# Altium schematic sheet USB2_Replication.SchDoc
size B; SheetNumber: 4; SheetTotal: 11
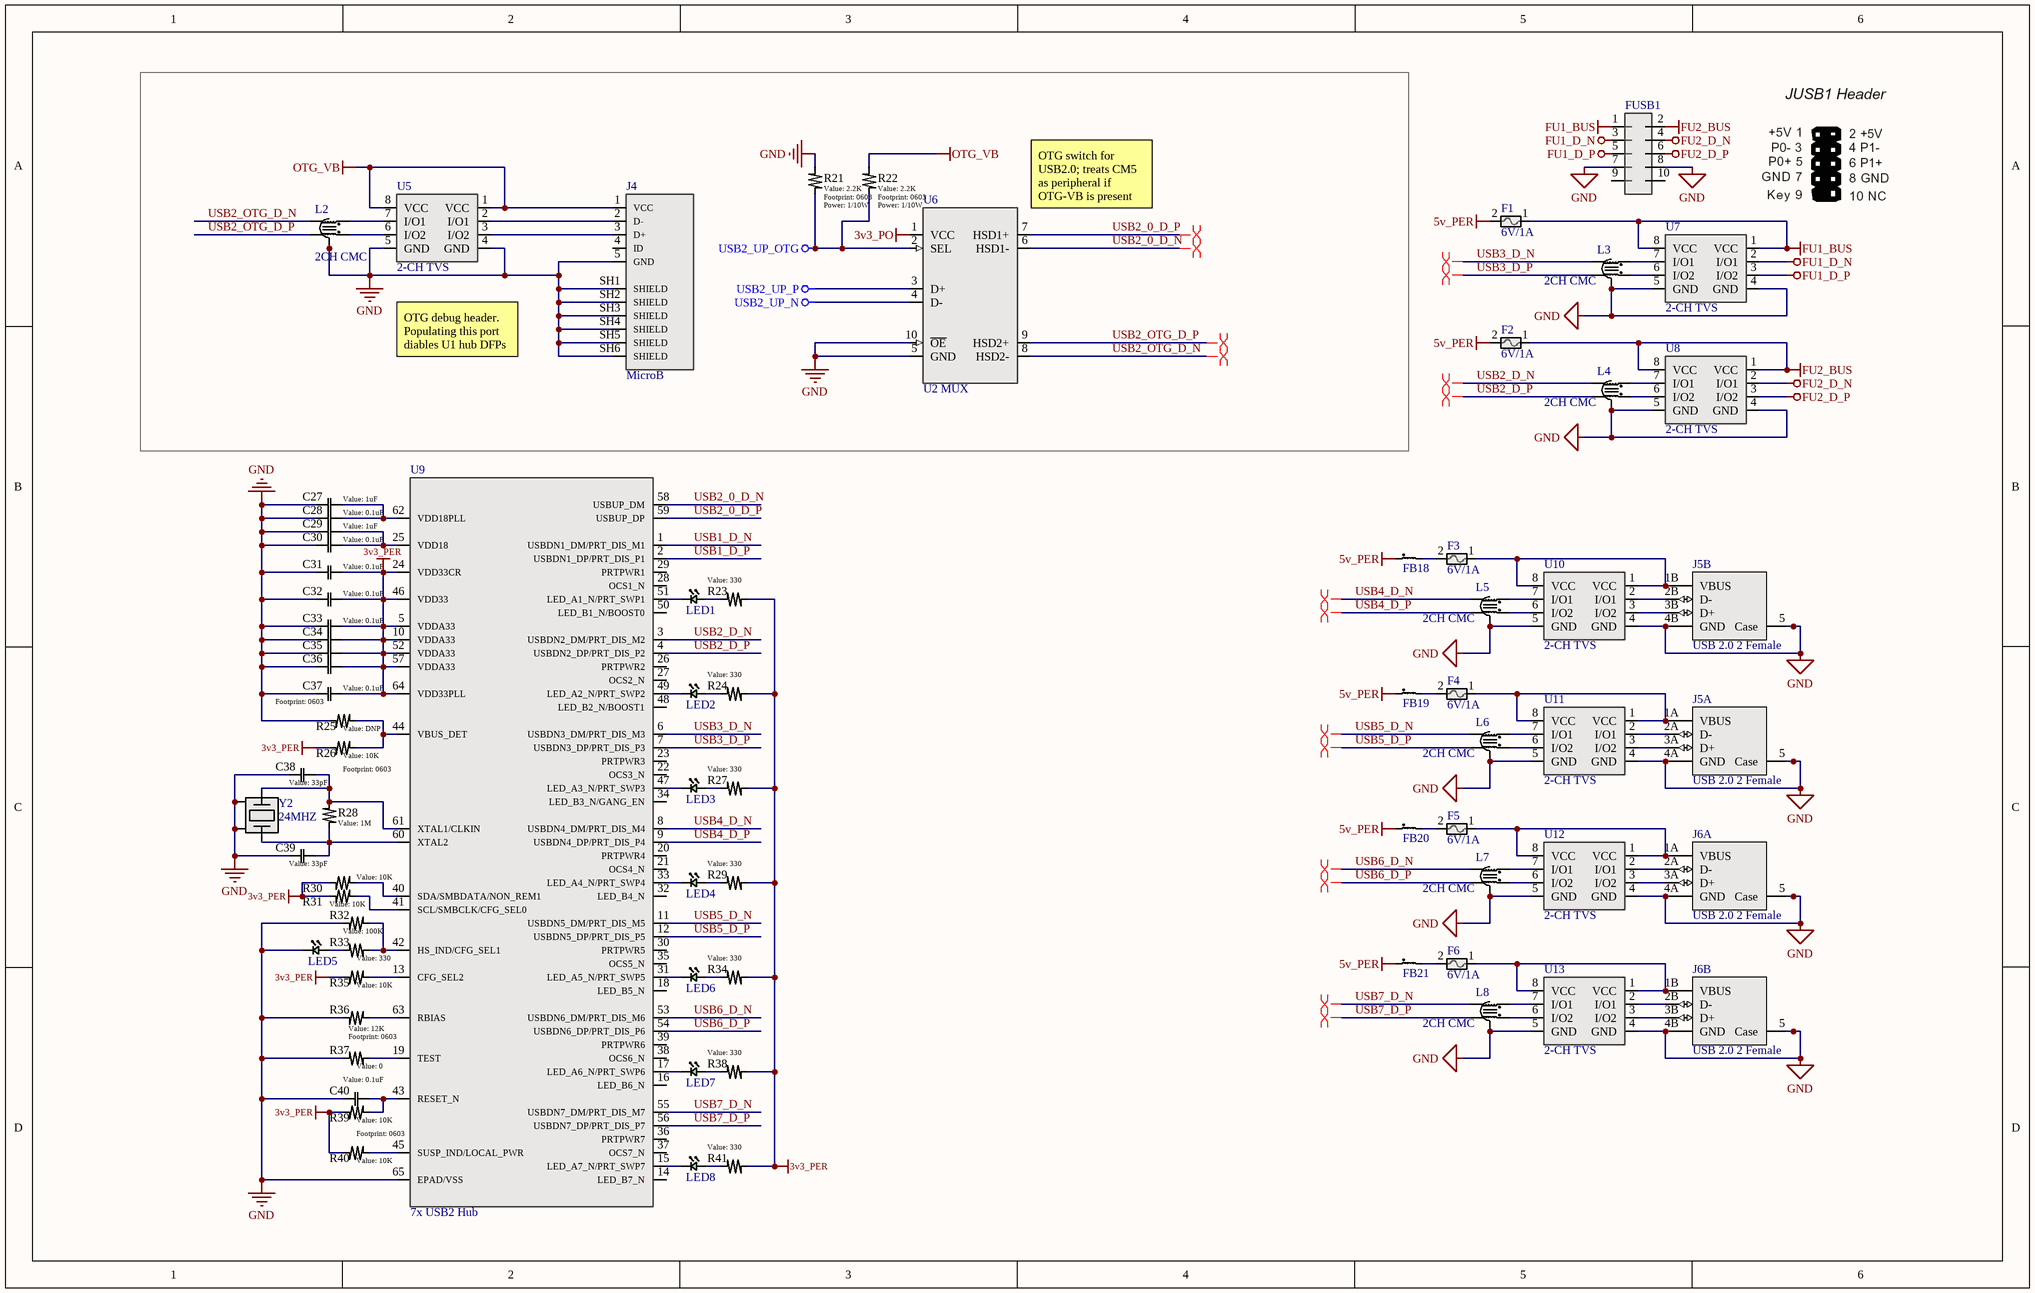
[diagram p0: USB2_Replication.SchDoc]

## Parts
C27  value 1uF  [0603]  (hidden comment: Generic Capacitor)
C28  value 0.1uF  [0603]  (hidden comment: Generic Capacitor)
C29  value 1uF  [0603]  (hidden comment: Generic Capacitor)
C30  value 0.1uF  [0603]  (hidden comment: Generic Capacitor)
C31  value 0.1uF  [0603]  (hidden comment: Generic Capacitor)
C32  value 0.1uF  [0603]  (hidden comment: Generic Capacitor)
C33  value 0.1uF  [0603]  (hidden comment: Generic Capacitor)
C34  Generic Capacitor  [0603]  (value not drawn)
C35  Generic Capacitor  [0603]  (value not drawn)
C36  Generic Capacitor  [0603]  (value not drawn)
C37  value 0.1uF  [0603]  (hidden comment: Generic Capacitor)
C38  value 33pF  [0603]  (hidden comment: Generic Capacitor)
C39  value 33pF  [0603]  (hidden comment: Generic Capacitor)
C40  value 0.1uF  [0603]  (hidden comment: Generic Capacitor)
F1  6V/1A  [0805]
F2  6V/1A  [0805]
F3  6V/1A  [0805]
F4  6V/1A  [0805]
F5  6V/1A  [0805]
F6  6V/1A  [0805]
FB18  0603 Ferrite  [0603]  (value not drawn)
FB19  0603 Ferrite  [0603]  (value not drawn)
FB20  0603 Ferrite  [0603]  (value not drawn)
FB21  0603 Ferrite  [0603]  (value not drawn)
FUSB1  10pinMobo  [10pinMobo]  (value not drawn)
J4  MicroB  [10118194-0001LF]
J5  USB 2.0 2 Female  [907-111A1022D10200]  (parts A,B of 2)
J6  USB 2.0 2 Female  [907-111A1022D10200]  (parts A,B of 2)
L2  2CH CMC  [SMD-6-2CH]
L3  2CH CMC  [SMD-6-2CH]
L4  2CH CMC  [SMD-6-2CH]
L5  2CH CMC  [SMD-6-2CH]
L6  2CH CMC  [SMD-6-2CH]
L7  2CH CMC  [SMD-6-2CH]
L8  2CH CMC  [SMD-6-2CH]
LED1  LTST-C191KGKT  [0603 (1608 Metric) Concave]  (value not drawn)
LED2  LTST-C191KGKT  [0603 (1608 Metric) Concave]  (value not drawn)
LED3  LTST-C191KGKT  [0603 (1608 Metric) Concave]  (value not drawn)
LED4  LTST-C191KGKT  [0603 (1608 Metric) Concave]  (value not drawn)
LED5  LTST-C191KGKT  [0603 (1608 Metric) Concave]  (value not drawn)
LED6  LTST-C191KGKT  [0603 (1608 Metric) Concave]  (value not drawn)
LED7  LTST-C191KGKT  [0603 (1608 Metric) Concave]  (value not drawn)
LED8  LTST-C191KGKT  [0603 (1608 Metric) Concave]  (value not drawn)
R21  value 2.2K  Power: 1/10W  [0603]  (hidden comment: Generic Resistor)
R22  value 2.2K  Power: 1/10W  [0603]  (hidden comment: Generic Resistor)
R23  value 330  [0603]  (hidden comment: Generic Resistor)
R24  value 330  [0603]  (hidden comment: Generic Resistor)
R25  value DNP  [0603]  (hidden comment: Generic Resistor)
R26  value 10K  [0603]  (hidden comment: Generic Resistor)
R27  value 330  [0603]  (hidden comment: Generic Resistor)
R28  value 1M  [0603]  (hidden comment: Generic Resistor)
R29  value 330  [0603]  (hidden comment: Generic Resistor)
R30  value 10K  [0603]  (hidden comment: Generic Resistor)
R31  value 10K  [0603]  (hidden comment: Generic Resistor)
R32  value 100K  [0603]  (hidden comment: Generic Resistor)
R33  value 330  [0603]  (hidden comment: Generic Resistor)
R34  value 330  [0603]  (hidden comment: Generic Resistor)
R35  value 10K  [0603]  (hidden comment: Generic Resistor)
R36  value 12K  [0603]  (hidden comment: Generic Resistor)
R37  value 0  [0603]  (hidden comment: Generic Resistor)
R38  value 330  [0603]  (hidden comment: Generic Resistor)
R39  value 10K  [0603]  (hidden comment: Generic Resistor)
R40  value 10K  [0603]  (hidden comment: Generic Resistor)
R41  value 330  [0603]  (hidden comment: Generic Resistor)
U5  2-CH TVS  [8-SOIC]
U6  U2 MUX  [MSOP-10]
U7  2-CH TVS  [8-SOIC]
U8  2-CH TVS  [8-SOIC]
U9  7x USB2 Hub  [QFN-64]
U10  2-CH TVS  [8-SOIC]
U11  2-CH TVS  [8-SOIC]
U12  2-CH TVS  [8-SOIC]
U13  2-CH TVS  [8-SOIC]
Y2  24MHZ  [SMD2520-4P]

## Nets
3v3_PER: C31.1 C32.1 C33.1 C34.1 C35.1 C36.1 C37.1 R23.2 R24.2 R26.1 R27.2 R29.2 R30.1 R31.1 R34.2 R35.1 R38.2 R39.1 R40.1 R41.2 U9.5(VDDA33) U9.10(VDDA33) U9.24(VDD33CR) U9.46(VDD33) U9.52(VDDA33) U9.57(VDDA33) U9.64(VDD33PLL)
3v3_PO: U6.1(VCC)
5v_PER: F1.2 F2.2 FB18.1 FB19.1 FB20.1 FB21.1
FU1_BUS: F1.1 FUSB1.1 U7.1(VCC) U7.8(VCC)
FU1_D_N: FUSB1.3 U7.2(I/O1)
FU1_D_P: FUSB1.5 U7.3(I/O2)
FU2_BUS: F2.1 FUSB1.2 U8.1(VCC) U8.8(VCC)
FU2_D_N: FUSB1.4 U8.2(I/O1)
FU2_D_P: FUSB1.6 U8.3(I/O2)
GND: C27.2 C28.2 C29.2 C30.2 C31.2 C32.2 C33.2 C34.2 C35.2 C36.2 C37.2 C38.2 C39.2 C40.2 FUSB1.7 FUSB1.8 J4.5(GND) J4.SH1(SHIELD) J4.SH2(SHIELD) J4.SH3(SHIELD) J4.SH4(SHIELD) J4.SH5(SHIELD) J4.SH6(SHIELD) J5.4A(GND) J5.4B(GND) J5.5(Case) J6.4A(GND) J6.4B(GND) J6.5(Case) L2.5 L2.6 L3.5 L3.6 L4.5 L4.6 L5.5 L5.6 L6.5 L6.6 L7.5 L7.6 L8.5 L8.6 LED5.1(Cathode) R21.1 R25.1 R32.1 R36.1 R37.1 U5.4(GND) U5.5(GND) U6.5(GND) U6.10(~{OE}) U7.4(GND) U7.5(GND) U8.4(GND) U8.5(GND) U9.65(EPAD/VSS) U10.4(GND) U10.5(GND) U11.4(GND) U11.5(GND) U12.4(GND) U12.5(GND) U13.4(GND) U13.5(GND) Y2.2(GND) Y2.4(GND)
OTG_VB: J4.1(VCC) R22.1 U5.1(VCC) U5.8(VCC)
USB2_UP_N: U6.4(D-)
USB2_UP_OTG: R21.2 R22.2 U6.2(SEL)
USB2_UP_P: U6.3(D+)
USB1_D_N: U9.1(USBDN1_DM/PRT_DIS_M1)
USB1_D_P: U9.2(USBDN1_DP/PRT_DIS_P1)
USB2_0_D_N: U6.6(HSD1-) U9.58(USBUP_DM)
USB2_0_D_P: U6.7(HSD1+) U9.59(USBUP_DP)
USB2_D_N: L4.4 U9.3(USBDN2_DM/PRT_DIS_M2)
USB2_D_P: L4.3 U9.4(USBDN2_DP/PRT_DIS_P2)
USB2_OTG_D_N: L2.4 U6.8(HSD2-)
USB2_OTG_D_P: L2.3 U6.9(HSD2+)
USB3_D_N: L3.4 U9.6(USBDN3_DM/PRT_DIS_M3)
USB3_D_P: L3.3 U9.7(USBDN3_DP/PRT_DIS_P3)
USB4_D_N: L5.4 U9.8(USBDN4_DM/PRT_DIS_M4)
USB4_D_P: L5.3 U9.9(USBDN4_DP/PRT_DIS_P4)
USB5_D_N: L6.4 U9.11(USBDN5_DM/PRT_DIS_M5)
USB5_D_P: L6.3 U9.12(USBDN5_DP/PRT_DIS_P5)
USB6_D_N: L7.4 U9.53(USBDN6_DM/PRT_DIS_M6)
USB6_D_P: L7.3 U9.54(USBDN6_DP/PRT_DIS_P6)
USB7_D_N: L8.4 U9.55(USBDN7_DM/PRT_DIS_M7)
USB7_D_P: L8.3 U9.56(USBDN7_DP/PRT_DIS_P7)
NetC27_1: C27.1 C28.1 U9.62(VDD18PLL)
NetC29_1: C29.1 C30.1 U9.25(VDD18)
NetC38_1: C38.1 R28.1 U9.61(XTAL1/CLKIN) Y2.1
NetC39_1: C39.1 R28.2 U9.60(XTAL2) Y2.3
NetC40_1: C40.1 R39.2 U9.43(RESET_N)
NetF3_1: F3.1 J5.1B(VBUS) U10.1(VCC) U10.8(VCC)
NetF3_2: F3.2 FB18.2
NetF4_1: F4.1 J5.1A(VBUS) U11.1(VCC) U11.8(VCC)
NetF4_2: F4.2 FB19.2
NetF5_1: F5.1 J6.1A(VBUS) U12.1(VCC) U12.8(VCC)
NetF5_2: F5.2 FB20.2
NetF6_1: F6.1 J6.1B(VBUS) U13.1(VCC) U13.8(VCC)
NetF6_2: F6.2 FB21.2
NetJ4_2: J4.2(D-) U5.2(I/O1)
NetJ4_3: J4.3(D+) U5.3(I/O2)
NetJ5_2A: J5.2A(D-) U11.2(I/O1)
NetJ5_2B: J5.2B(D-) U10.2(I/O1)
NetJ5_3A: J5.3A(D+) U11.3(I/O2)
NetJ5_3B: J5.3B(D+) U10.3(I/O2)
NetJ6_2A: J6.2A(D-) U12.2(I/O1)
NetJ6_2B: J6.2B(D-) U13.2(I/O1)
NetJ6_3A: J6.3A(D+) U12.3(I/O2)
NetJ6_3B: J6.3B(D+) U13.3(I/O2)
NetL2_1: L2.1 U5.7(I/O1)
NetL2_2: L2.2 U5.6(I/O2)
NetL3_1: L3.1 U7.7(I/O1)
NetL3_2: L3.2 U7.6(I/O2)
NetL4_1: L4.1 U8.7(I/O1)
NetL4_2: L4.2 U8.6(I/O2)
NetL5_1: L5.1 U10.7(I/O1)
NetL5_2: L5.2 U10.6(I/O2)
NetL6_1: L6.1 U11.7(I/O1)
NetL6_2: L6.2 U11.6(I/O2)
NetL7_1: L7.1 U12.7(I/O1)
NetL7_2: L7.2 U12.6(I/O2)
NetL8_1: L8.1 U13.7(I/O1)
NetL8_2: L8.2 U13.6(I/O2)
NetLED1_1: LED1.1(Cathode) U9.51(LED_A1_N/PRT_SWP1)
NetLED1_2: LED1.2(Anode) R23.1
NetLED2_1: LED2.1(Cathode) U9.49(LED_A2_N/PRT_SWP2)
NetLED2_2: LED2.2(Anode) R24.1
NetLED3_1: LED3.1(Cathode) U9.47(LED_A3_N/PRT_SWP3)
NetLED3_2: LED3.2(Anode) R27.1
NetLED4_1: LED4.1(Cathode) U9.33(LED_A4_N/PRT_SWP4)
NetLED4_2: LED4.2(Anode) R29.1
NetLED5_2: LED5.2(Anode) R33.1
NetLED6_1: LED6.1(Cathode) U9.31(LED_A5_N/PRT_SWP5)
NetLED6_2: LED6.2(Anode) R34.1
NetLED7_1: LED7.1(Cathode) U9.17(LED_A6_N/PRT_SWP6)
NetLED7_2: LED7.2(Anode) R38.1
NetLED8_1: LED8.1(Cathode) U9.15(LED_A7_N/PRT_SWP7)
NetLED8_2: LED8.2(Anode) R41.1
NetR25_2: R25.2 R26.2 U9.44(VBUS_DET)
NetR30_2: R30.2 U9.40(SDA/SMBDATA/NON_REM1)
NetR31_2: R31.2 U9.41(SCL/SMBCLK/CFG_SEL0)
NetR32_2: R32.2 R33.2 U9.42(HS_IND/CFG_SEL1)
NetR35_2: R35.2 U9.13(CFG_SEL2)
NetR36_2: R36.2 U9.63(RBIAS)
NetR37_2: R37.2 U9.19(TEST)
NetR40_2: R40.2 U9.45(SUSP_IND/LOCAL_PWR)

Not connected (* = marked no-connect by the designer): FUSB1 9 10; J4 4(ID); U9 14(LED_B7_N) 16(LED_B6_N) 18(LED_B5_N) 20(PRTPWR4) 21(OCS4_N) 22(OCS3_N) 23(PRTPWR3) 26(PRTPWR2) 27(OCS2_N) 28(OCS1_N) 29(PRTPWR1) 30(PRTPWR5) 32(LED_B4_N) 34(LED_B3_N/GANG_EN) 35(OCS5_N) 36(PRTPWR7) 37(OCS7_N) 38(OCS6_N) 39(PRTPWR6) 48(LED_B2_N/BOOST1) 50(LED_B1_N/BOOST0)

## Layout directives
differential pair: USB2_0_D_N, USB2_0_D_P, USB2_D_N, USB2_D_P, USB2_OTG_D_N, USB2_OTG_D_P, USB3_D_N, USB3_D_P, USB4_D_N, USB4_D_P, USB5_D_N, USB5_D_P, USB6_D_N, USB6_D_P, USB7_D_N, USB7_D_P

## Notes on the sheet
- (near U6) OTG switch for USB2.0; treats CM5 as peripheral if OTG-VB is present
- OTG debug header. Populating this port diables U1 hub DFPs
- REV
- REVISIONS
- DATE
- DESCRIPTION
- BY
- UNLESS OTHERWISE SPECIFIED, DRAWING DEFINITIONS AND TOLERANCES SHALL BE FOUND UNDER SUPPLIER STANDARDS SS-001. THIS PART AND ALL COMPONENTS OF IT MUST BE RoHS & REACH COMPLIANT. A CERTIFICATE OF COMPLIANCE MUST BE PROVIDED UPON REQUEST.
- ALL INFORMATION ON THIS DOCUMENT IS THE SOLE PROPERTY OF GAMBER-JOHNSON AND SHALL NOT BE COPIED, REPRODUCED, USED OR DISCLOSED IN WHOLE OR IN PART WITHOUT THE WRITTEN CONSENT OF GAMBER-JOHNSON
- TOLERANCES
  .00 ± .060
  .000 ± .020
  .0000 ± .005
  ANGELS ± 1°
- DRAWN BY:
- PROJECT NUMBER:
- SHEET TITLE:
- SHEET
- OF
- DATE:
- LOCATION:
- ASSEMBLY NUMBER
- SIZE
- GAMBER-JOHNSON LLC
  5001 JOERNS DR.
  STEVENS POINT, WI 54481
  +1 (715) 344-5209
- B

## Library data of the parts
C27-C33 C37-C40 = Generic Capacitor: Voltage: 10V; Tolerance: 10%
C34-C36 = Generic Capacitor: Voltage: 10V; Tolerance: 10%; Value: 0.1uF
F1-F6 = 0ZCK0100FF2E: Polymeric PTC Resettable Fuse 6V 1 A Ih Surface Mount 0805 (2012 Metric), Concave; Manufacturer: Bel; Max Current Rating: 40A; Hold Current: 1A; Trip Current: 1.95A; Time to Trip: 0.3s; Supplier 1: Digi-Key; Supplier Part Number 1: 507-1815-1-ND; Manufacturer Part Number: 0ZCK0100FF2E; RoHS: Yes; Category: PTC Resettable Fuses; Stock 1: 74738; Pricing 1: 1=0.27000, 5=0.26600, 10=0.25400, 50=0.22620, 100=0.21060, 250=0.18720, 500=0.15600, 1000=0.14820 (USD); Mount: Surface Mount; Case/Package: 0805; Case Code (Metric): 2012; Case Code (Imperial): 0805; Contact Plating: Tin,Matte; Min Operating Temperature: -40°C; Max Operating Temperature: 85°C; Package Quantity: 1; Packaging: Tape and Reel; RoHS Compliant: Yes; ComponentLink1URL: https://datasheet.ciiva.com/18550/0zck-18550620.pdf?src-supplier=Digi-Key; ComponentLink1Description: https://datasheet.ciiva.com/18550/0zck-18550620.pdf?src-supplier=Digi-Key; ComponentLink2URL: https://datasheet.ciiva.com/18550/0zck-18550621.pdf?src-supplier=Digi-Key; ComponentLink2Description: https://datasheet.ciiva.com/18550/0zck-18550621.pdf?src-supplier=Digi-Key; ComponentLink3URL: https://datasheet.ciiva.com/18550/0zck-18550622.pdf?src-supplier=Digi-Key; ComponentLink3Description: https://datasheet.ciiva.com/18550/0zck-18550622.pdf?src-supplier=Digi-Key; LCSC PN: C883112
FB18-FB21 = PE-0603FB121ST: 120 Ohms @ 100 MHz 1 Signal Line Ferrite Bead 0603 (1608 Metric) 500mA 180mOhm; Manufacturer: Pulse; Number of Lines: 1; DC Resistance (DCR): 180mR; Supplier 1: Digi-Key; Supplier Part Number 1: 553-2382-1-ND; Manufacturer Part Number: PE-0603FB121ST; RoHS: Yes; Category: Inductors; Stock 1: 6181; Pricing 1: 1=0.10000, 10=0.04400, 25=0.03920, 50=0.03580, 100=0.03220, 250=0.02360, 500=0.01716, 1000=0.01680 (USD); Mount: Surface Mount; Case/Package: 0603; Case Code (Metric): 1608; Case Code (Imperial): 0603; Min Operating Temperature: -40°C; Max Operating Temperature: 105°C; Package Quantity: 4000; Packaging: Tape and Reel; Max Current Rating: 500mA; Length: 0.063inch; Width: 0.031inch; Height: 0.037inch; RoHS Compliant: Yes; ComponentLink1URL: https://productfinder.pulseeng.com/doc_type/WEB301/doc_num/WC706/doc_part/WC706.pdf?src-supplier=Digi-Key; ComponentLink1Description: https://productfinder.pulseeng.com/doc_type/WEB301/doc_num/WC706/doc_part/WC706.pdf?src-supplier=Digi-Key; ComponentLink2URL: http://productfinder.pulseeng.com/products/datasheets/WC706.pdf?src-supplier=Digi-Key; ComponentLink2Description: http://productfinder.pulseeng.com/products/datasheets/WC706.pdf?src-supplier=Digi-Key; LCSC PN: C275486
FUSB1 = 10pinMobo: 10pin motherboard jack
J4 = 10118194-0001LF: Micro USB, Input Output Connectors, B TYPE RECEPTACLE with flange; MF: Amphenol ICC; SnapEDA_Link: https://www.snapeda.com/parts/10118194-0001LF/Amphenol+FCI/view-part/?ref=snap; Package: None; Value: *; MP: 10118194-0001LF; Check_prices: https://www.snapeda.com/parts/10118194-0001LF/Amphenol+FCI/view-part/?ref=eda; LCSC PN: C132563
J5 J6 = 907-111A1022D10200: USB 2.0 2 8 Female Type-A Plugin USB Connectors ROHS; LCSC PN: C12049
L2-L8 = ICMEF112P350MFR: 35Ω@100MHz -40℃~+85℃ 4Ω 5V 2 100mA SMD Common Mode Filters ROHS; LCSC PN: C396460; Supplier 1: Mouser; Supplier Part Number 1: 710-748020024
LED1-LED8 = CMP-013-000000-1: LED Uni-Color Green 574nm 2-Pin Chip LED T/R; Manufacturer 1: Vishay Lite-On; Number of Elements: 1; Viewing Angle: 130°; Lens Transparency: Clear; Power Dissipation: 75mW; Test Current: 20mA; Lens Style: Rectangular,Colorless; Reverse Voltage: 5V; Lens Color: Colorless; Forward Current: 30mA; Dominant Wavelength: 571nm; Forward Voltage: 2V; Luminous Intensity: 35mcd; Case Code (Imperial): 0603; Width: 0.8mm; Depth: 0.8mm; Case Code (Metric): 1608; Packaging: Tape and Reel; Number of LEDs: 1; Lead Free: Lead Free; Package Quantity: 1; Illumination Color: Green; Design Item ID: LTST-C191KGKT; Color: Green; Mount: Surface Mount; Source: Diodes.SchLib; Radiation Hardening: No; Wavelength: 574nm; RoHS: Yes; Max Power Dissipation: 75mW; RoHS Compliant: Yes; Power Rating: 75mW; Case/Package: 0603; Length: 1.6mm; Component Type: Standard; Number of Pins: 2; Height: 0.55mm; Stock 1: 4150; Pin Count: 2; ComponentLink1Description: https://datasheet.ciiva.com/2109/ltst-c191kgkt-2109973.pdf?src-supplier=Digi-Key; Manufacturer Part Number 1: LTST-C191KGKT; Category: LEDs; Min Operating Temperature: -55°C; ComponentLink1URL: https://datasheet.ciiva.com/2109/ltst-c191kgkt-2109973.pdf?src-supplier=Digi-Key; Max Operating Temperature: 85°C; Pricing 1: 50=0.14800, 250=0.06800, 500=0.06400, 1250=0.05400, 2500=0.05100 (USD)
R21 R22 = Generic Resistor: Tolerance: 1%
R23-R41 = Generic Resistor: Tolerance: 1%; Power: 1/10W
U5 U7 U8 U10-U13 = USB6B1RL: TVS DIODE 5.25VWM 8-SOIC; Mfr_Name: STMicroelectronics; RefDes: RefDes; Type: Type; Supplier 1: Future Electronics; Supplier Part Number 1: 5702279; LCSC PN: C10508
U6 = FSUSB42MUX: FSUSB42 Series DPDT 4.3 V 480 Mbps SMT Hi Speed USB 2.0 Switch - MSOP-10; MF: ON Semiconductor; SnapEDA_Link: https://www.snapeda.com/parts/FSUSB42MUX/Onsemi/view-part/?ref=snap; Package: MSOP-10 ON Semiconductor; Value: *; MP: FSUSB42MUX; Check_prices: https://www.snapeda.com/parts/FSUSB42MUX/Onsemi/view-part/?ref=eda; LCSC PN: C11355; Supplier 1: Digikey; Supplier Part Number 1: FSUSB42MUXCT-ND
U9 = USB2517-JZX: USB Hub Controller USB 2.0 USB Interface 64-QFN (9x9); Mfr_Name: Microchip; RefDes: RefDes; Type: Type; LCSC PN: C1521556; Supplier 1: Avnet; Supplier Part Number 1: USB2517I-JZX; Supplier 2: Newark; Supplier Part Number 2: 66W2139; Supplier 3: Newark; Supplier Part Number 3: 41AH8631
Y2 = CM4024M00020001: 24MHz 20pF ±10ppm ±30ppm SMD-2520-4P Crystals ROHS; LCSC PN: C284163